# EAGLE design TreeRocketometer (EAGLE 6.2)
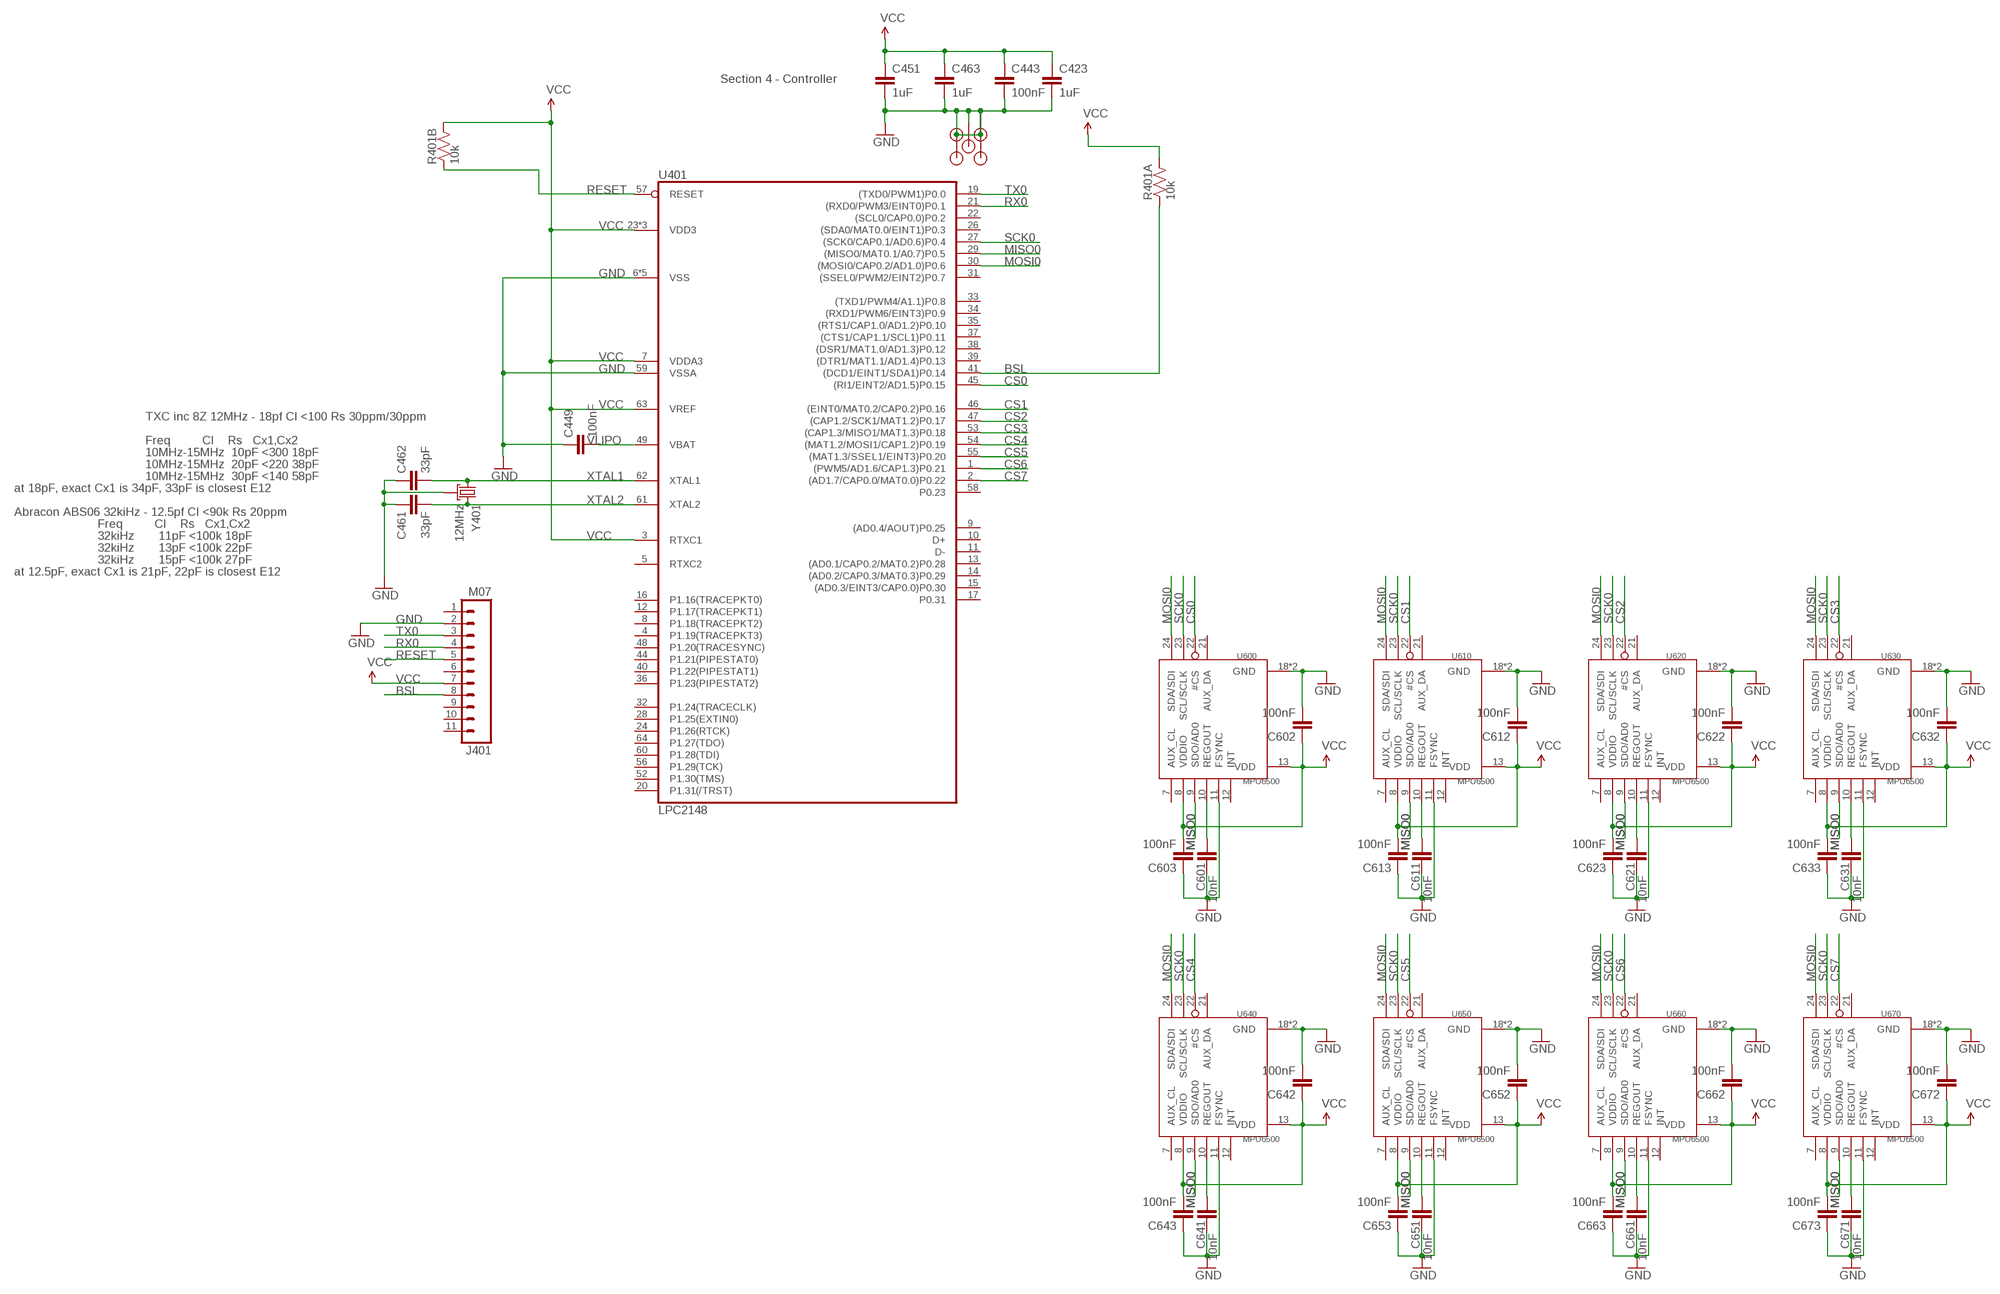
[diagram p0: schematic, sheet 1]

## Parts
C423  1uF  CAP0402-CAP  [0402-CAP]
C443  100nF  CAP0402-CAP  [0402-CAP]
C449  100nF  CAP0402-CAP  [0402-CAP]
C451  1uF  CAP0402-CAP  [0402-CAP]
C461  33pF  CAP0402-CAP  [0402-CAP]
C462  33pF  CAP0402-CAP  [0402-CAP]
C463  1uF  CAP0402-CAP  [0402-CAP]
C601  10nF  CAP0402-CAP  [0402-CAP]
C602  100nF  CAP0402-CAP  [0402-CAP]
C603  100nF  CAP0402-CAP  [0402-CAP]
C611  10nF  CAP0402-CAP  [0402-CAP]
C612  100nF  CAP0402-CAP  [0402-CAP]
C613  100nF  CAP0402-CAP  [0402-CAP]
C621  10nF  CAP0402-CAP  [0402-CAP]
C622  100nF  CAP0402-CAP  [0402-CAP]
C623  100nF  CAP0402-CAP  [0402-CAP]
C631  10nF  CAP0402-CAP  [0402-CAP]
C632  100nF  CAP0402-CAP  [0402-CAP]
C633  100nF  CAP0402-CAP  [0402-CAP]
C641  10nF  CAP0402-CAP  [0402-CAP]
C642  100nF  CAP0402-CAP  [0402-CAP]
C643  100nF  CAP0402-CAP  [0402-CAP]
C651  10nF  CAP0402-CAP  [0402-CAP]
C652  100nF  CAP0402-CAP  [0402-CAP]
C653  100nF  CAP0402-CAP  [0402-CAP]
C661  10nF  CAP0402-CAP  [0402-CAP]
C662  100nF  CAP0402-CAP  [0402-CAP]
C663  100nF  CAP0402-CAP  [0402-CAP]
C671  10nF  CAP0402-CAP  [0402-CAP]
C672  100nF  CAP0402-CAP  [0402-CAP]
C673  100nF  CAP0402-CAP  [0402-CAP]
J401  M07  M11PTH  [1X11]
JP1  STANDOFF  [STANDOFF]
JP2  STANDOFF  [STANDOFF]
JP3  STANDOFF  [STANDOFF]
JP4  STANDOFF  [STANDOFF]
JP5  STANDOFF  [STANDOFF]
R401  10k  RP404  [CRA04]
U401  LPC2148  [LQFP64]
U600  MPU6500  [QFN24]
U610  MPU6500  [QFN24]
U620  MPU6500  [QFN24]
U630  MPU6500  [QFN24]
U640  MPU6500  [QFN24]
U650  MPU6500  [QFN24]
U660  MPU6500  [QFN24]
U670  MPU6500  [QFN24]
Y401  12MHz  CX2520  [CRYSTAL_SMD_2MM_2_5MM]

## Nets
BSL: J401.8 R401.1 U401.41((DCD1/EINT1/SDA1)P0.14)
CS0: U401.45((RI1/EINT2/AD1.5)P0.15) U600.22(#CS)
CS1: U401.46((EINT0/MAT0.2/CAP0.2)P0.16) U610.22(#CS)
CS2: U401.47((CAP1.2/SCK1/MAT1.2)P0.17) U620.22(#CS)
CS3: U401.53((CAP1.3/MISO1/MAT1.3)P0.18) U630.22(#CS)
CS4: U401.54((MAT1.2/MOSI1/CAP1.2)P0.19) U640.22(#CS)
CS5: U401.55((MAT1.3/SSEL1/EINT3)P0.20) U650.22(#CS)
CS6: U401.1((PWM5/AD1.6/CAP1.3)P0.21) U660.22(#CS)
CS7: U401.2((AD1.7/CAP0.0/MAT0.0)P0.22) U670.22(#CS)
GND [power]: C423.2 C443.2 C449.1 C451.2 C461.1 C462.1 C463.2 C601.2 C602.2 C603.1 C611.2 C612.2 C613.1 C621.2 C622.2 C623.1 C631.2 C632.2 C633.1 C641.2 C642.2 C643.1 C651.2 C652.2 C653.1 C661.2 C662.2 C663.1 C671.2 C672.2 C673.1 J401.2 JP1.P$1 JP2.P$1 JP3.P$1 JP4.P$1 JP5.P$1 U401.6(VSS) U401.18(VSS) U401.25(VSS) U401.42(VSS) U401.50(VSS) U401.59(VSSA) U600.11(FSYNC) U600.18(GND) U600.20(GND) U610.11(FSYNC) U610.18(GND) U610.20(GND) U620.11(FSYNC) U620.18(GND) U620.20(GND) U630.11(FSYNC) U630.18(GND) U630.20(GND) U640.11(FSYNC) U640.18(GND) U640.20(GND) U650.11(FSYNC) U650.18(GND) U650.20(GND) U660.11(FSYNC) U660.18(GND) U660.20(GND) U670.11(FSYNC) U670.18(GND) U670.20(GND) Y401.2(GND) Y401.4(GND)
MISO0: U401.29((MISO0/MAT0.1/A0.7)P0.5) U600.9(SDO/AD0) U610.9(SDO/AD0) U620.9(SDO/AD0) U630.9(SDO/AD0) U640.9(SDO/AD0) U650.9(SDO/AD0) U660.9(SDO/AD0) U670.9(SDO/AD0)
MOSI0: U401.30((MOSI0/CAP0.2/AD1.0)P0.6) U600.24(SDA/SDI) U610.24(SDA/SDI) U620.24(SDA/SDI) U630.24(SDA/SDI) U640.24(SDA/SDI) U650.24(SDA/SDI) U660.24(SDA/SDI) U670.24(SDA/SDI)
N$1: C611.1 U610.10(REGOUT)
N$2: C621.1 U620.10(REGOUT)
N$3: C601.1 U600.10(REGOUT)
N$4: C631.1 U630.10(REGOUT)
N$5: C641.1 U640.10(REGOUT)
N$6: C651.1 U650.10(REGOUT)
N$7: C661.1 U660.10(REGOUT)
N$8: C671.1 U670.10(REGOUT)
RESET [power]: J401.5 R401.2 U401.57(RESET)
RX0: J401.4 U401.21((RXD0/PWM3/EINT0)P0.1)
SCK0: U401.27((SCK0/CAP0.1/AD0.6)P0.4) U600.23(SCL/SCLK) U610.23(SCL/SCLK) U620.23(SCL/SCLK) U630.23(SCL/SCLK) U640.23(SCL/SCLK) U650.23(SCL/SCLK) U660.23(SCL/SCLK) U670.23(SCL/SCLK)
TX0: J401.3 U401.19((TXD0/PWM1)P0.0)
VCC [power]: C423.1 C443.1 C451.1 C463.1 C602.1 C603.2 C612.1 C613.2 C622.1 C623.2 C632.1 C633.2 C642.1 C643.2 C652.1 C653.2 C662.1 C663.2 C672.1 C673.2 J401.7 R401.7 R401.8 U401.3(RTXC1) U401.7(VDDA3) U401.23(VDD3) U401.43(VDD3) U401.51(VDD3) U401.63(VREF) U600.8(VDDIO) U600.13(VDD) U610.8(VDDIO) U610.13(VDD) U620.8(VDDIO) U620.13(VDD) U630.8(VDDIO) U630.13(VDD) U640.8(VDDIO) U640.13(VDD) U650.8(VDDIO) U650.13(VDD) U660.8(VDDIO) U660.13(VDD) U670.8(VDDIO) U670.13(VDD)
VLIPO [power]: C449.2 U401.49(VBAT)
XTAL1: C462.2 U401.62(XTAL1) Y401.1
XTAL2: C461.2 U401.61(XTAL2) Y401.3
Unconnected: J401.1 J401.6 J401.9 J401.10 J401.11 R401.3 R401.4 R401.5 R401.6 U401.4(P1.19(TRACEPKT3)) U401.5(RTXC2) U401.8(P1.18(TRACEPKT2)) U401.9((AD0.4/AOUT)P0.25) U401.10(D+) U401.11(D-) U401.12(P1.17(TRACEPKT1)) U401.13((AD0.1/CAP0.2/MAT0.2)P0.28) U401.14((AD0.2/CAP0.3/MAT0.3)P0.29) U401.15((AD0.3/EINT3/CAP0.0)P0.30) U401.16(P1.16(TRACEPKT0)) U401.17(P0.31) U401.20(P1.31(/TRST)) U401.22((SCL0/CAP0.0)P0.2) U401.24(P1.26(RTCK)) U401.26((SDA0/MAT0.0/EINT1)P0.3) U401.28(P1.25(EXTIN0)) U401.31((SSEL0/PWM2/EINT2)P0.7) U401.32(P1.24(TRACECLK)) U401.33((TXD1/PWM4/A1.1)P0.8) U401.34((RXD1/PWM6/EINT3)P0.9) U401.35((RTS1/CAP1.0/AD1.2)P0.10) U401.36(P1.23(PIPESTAT2)) U401.37((CTS1/CAP1.1/SCL1)P0.11) U401.38((DSR1/MAT1.0/AD1.3)P0.12) U401.39((DTR1/MAT1.1/AD1.4)P0.13) U401.40(P1.22(PIPESTAT1)) U401.44(P1.21(PIPESTAT0)) U401.48(P1.20(TRACESYNC)) U401.52(P1.30(TMS)) U401.56(P1.29(TCK)) U401.58(P0.23) U401.60(P1.28(TDI)) U401.64(P1.27(TDO)) U600.7(AUX_CL) U600.12(INT) U600.21(AUX_DA) U610.7(AUX_CL) U610.12(INT) U610.21(AUX_DA) U620.7(AUX_CL) U620.12(INT) U620.21(AUX_DA) U630.7(AUX_CL) U630.12(INT) U630.21(AUX_DA) U640.7(AUX_CL) U640.12(INT) U640.21(AUX_DA) U650.7(AUX_CL) U650.12(INT) U650.21(AUX_DA) U660.7(AUX_CL) U660.12(INT) U660.21(AUX_DA) U670.7(AUX_CL) U670.12(INT) U670.21(AUX_DA)

## Notes on the sheet
- Section 4 - Controller
- TXC inc 8Z 12MHz - 18pf Cl <100 Rs 30ppm/30ppm
- Freq         Cl    Rs   Cx1,Cx2
- 10MHz-15MHz  10pF <300 18pF
- 10MHz-15MHz  20pF <220 38pF
- 10MHz-15MHz  30pF <140 58pF
- at 18pF, exact Cx1 is 34pF, 33pF is closest E12
- Abracon ABS06 32kiHz - 12.5pf Cl <90k Rs 20ppm
- Freq         Cl    Rs   Cx1,Cx2
- 32kiHz       11pF <100k 18pF
- 32kiHz       13pF <100k 22pF
- 32kiHz       15pF <100k 27pF
- at 12.5pF, exact Cx1 is 21pF, 22pF is closest E12

## Library data of the parts
C423 C451 C463 = SparkFun:CAP: Capacitor Standard 0603 ceramic capacitor, and 0.1" leaded capacitor.; DIGIKEY: 445-4114-1-ND
C443 C449 C601-C603 C611-C613 C621-C623 C631-C633 C641-C643 C651-C653 C661-C663 C671-C673 = SparkFun:CAP: Capacitor Standard 0603 ceramic capacitor, and 0.1" leaded capacitor.; DIGIKEY: 445-1265-1-ND
C461 C462 = SparkFun:CAP: Capacitor Standard 0603 ceramic capacitor, and 0.1" leaded capacitor.; DIGIKEY: 445-1241-1-ND
J401 = SparkFun-Connectors:M11: Header 11 Standard 11-pin 0.1" header. Use with straight break away headers (SKU : PRT-00116), right angle break away headers (PRT-00553), swiss pins (PRT-00743), machine pins (PRT-00117), and female headers (PRT-00115).; DIGIKEY: $NOPART
JP1-JP5 = KwanSystems:STANDOFF; DIGIKEY: $NOPART
R401 = KwanSystems:RP4; DIGIKEY: CRA4S810KCT-ND
U401 = KwanSystems:LPC2148
U600 U610 U620 U630 U640 U650 U660 U670 = KwanSystems:MPU6500
Y401 = KwanSystems:CX2520; DIGIKEY: 887-1487-1-ND

## Net classes
0 default: width 0.152 mm, drill 0.33 mm, clearance 0.152 mm
1 power: width 0.152 mm, drill 0.33 mm, clearance 0.152 mm to class 0, clearance 0.152 mm
2 hv: width 0.152 mm, drill 0.33 mm, clearance 0.152 mm to class 0, clearance 0.152 mm to class 1, clearance 0.152 mm

## Board
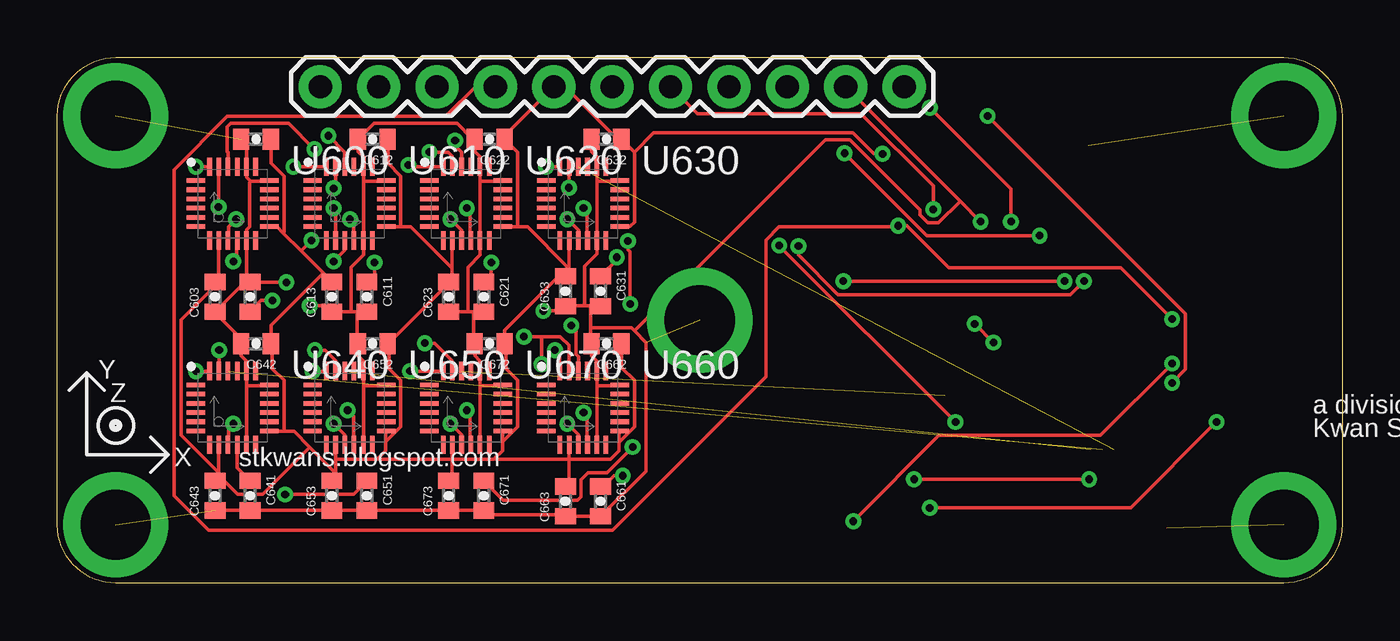
[diagram p1: board, top side]
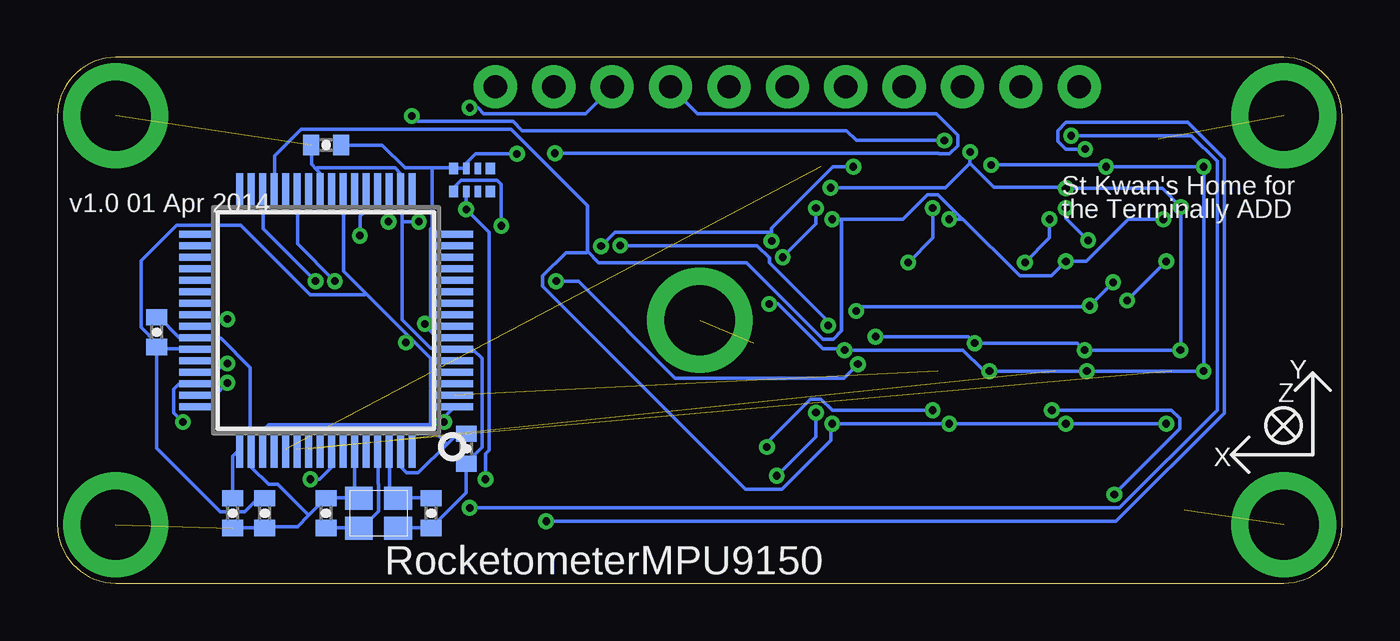
[diagram p2: board, bottom side, seen from below]

Size 55.88 x 22.86 mm. Coordinates in mm from the lower left corner, seen from the top.
Outline: 2.54,22.86 53.34,22.86 arc-90 55.88,20.32 55.88,2.54 arc-90 53.34,0 2.54,0 arc-90 0,2.54 0,20.32 arc-90 2.54,22.86
Copper layers (1*16): Top 0.0356mm / dielectric 1.5011mm / Bottom 0.0356mm
Design rules: minimum track width 6mil, minimum drill 13mil, track to track 6mil, track to pad 6mil, pad to pad 6mil, via to via 6mil, smd to smd 6mil, copper to edge 15mil, drill to drill 6mil, minimum pad ring 7mil, minimum via ring 7mil, stop-mask expansion 4mil, vias tented up to drill 14mil, thermal gap 10mil

### Footprints (pad centres in the part's own frame; a part is rotated, then mirrored left to right if it is on the bottom)
0402-CAP = smd 0.7 x 0.9: 1 -0.65,0; 2 0.65,0
1X11 = drill 1.016 pad 1.88: 1 0,0; 2 2.54,0; 3 5.08,0; 4 7.62,0; 5 10.16,0; 6 12.7,0; 7 15.24,0; 8 17.78,0; 9 20.32,0; 10 22.86,0; 11 25.4,0
STANDOFF = drill 3.048 pad 4.572: P$1 0,0
CRA04 = smd 0.4 x 0.5: 1 -0.8,-0.5; 4 0.8,-0.5; 5 0.8,0.5; 8 -0.8,0.5 | smd 0.3 x 0.5: 2 -0.25,-0.5; 3 0.25,-0.5; 6 0.25,0.5; 7 -0.25,0.5
LQFP64 = smd 0.3 x 1.6: 1 -3.75,-5.6; 2 -3.25,-5.6; 3 -2.75,-5.6; 4 -2.25,-5.6; 5 -1.75,-5.6; 6 -1.25,-5.6; 7 -0.75,-5.6; 8 -0.25,-5.6; 9 0.25,-5.6; 10 0.75,-5.6; 11 1.25,-5.6; 12 1.75,-5.6; 13 2.25,-5.6; 14 2.75,-5.6; 15 3.25,-5.6; 16 3.75,-5.6; 33 3.75,5.6; 34 3.25,5.6; 35 2.75,5.6; 36 2.25,5.6; 37 1.75,5.6; 38 1.25,5.6; 39 0.75,5.6; 40 0.25,5.6; 41 -0.25,5.6; 42 -0.75,5.6; 43 -1.25,5.6; 44 -1.75,5.6; 45 -2.25,5.6; 46 -2.75,5.6; 47 -3.25,5.6; 48 -3.75,5.6 | smd 1.6 x 0.3: 17 5.6,-3.75; 18 5.6,-3.25; 19 5.6,-2.75; 20 5.6,-2.25; 21 5.6,-1.75; 22 5.6,-1.25; 23 5.6,-0.75; 24 5.6,-0.25; 25 5.6,0.25; 26 5.6,0.75; 27 5.6,1.25; 28 5.6,1.75; 29 5.6,2.25; 30 5.6,2.75; 31 5.6,3.25; 32 5.6,3.75; 49 -5.6,3.75; 50 -5.6,3.25; 51 -5.6,2.75; 52 -5.6,2.25; 53 -5.6,1.75; 54 -5.6,1.25; 55 -5.6,0.75; 56 -5.6,0.25; 57 -5.6,-0.25; 58 -5.6,-0.75; 59 -5.6,-1.25; 60 -5.6,-1.75; 61 -5.6,-2.25; 62 -5.6,-2.75; 63 -5.6,-3.25; 64 -5.6,-3.75
QFN24 = smd 0.8 x 0.2: 1 -1.6,1; 2 -1.6,0.6; 3 -1.6,0.2; 4 -1.6,-0.2; 5 -1.6,-0.6; 6 -1.6,-1; 13 1.6,-1; 14 1.6,-0.6; 15 1.6,-0.2; 16 1.6,0.2; 17 1.6,0.6; 18 1.6,1 | smd 0.2 x 0.8: 7 -1,-1.6; 8 -0.6,-1.6; 9 -0.2,-1.6; 10 0.2,-1.6; 11 0.6,-1.6; 12 1,-1.6; 19 1,1.6; 20 0.6,1.6; 21 0.2,1.6; 22 -0.2,1.6; 23 -0.6,1.6; 24 -1,1.6
CRYSTAL_SMD_2MM_2_5MM = smd 1.2 x 1: 1 -0.85,-0.65; 2 0.85,-0.65; 3 0.85,0.65; 4 -0.85,0.65

### Placement (x,y rotation side)
C423  44.2,19.05 180 bottom
C443  51.56,10.92 90 bottom
C449  48.26,3.05 90 bottom
C451  46.86,3.05 270 bottom
C461  44.2,3.05 270 bottom
C462  39.62,3.05 90 bottom
C463  38.1,5.84 270 bottom
C601  8.38,12.45 90 top
C602  8.64,19.3 180 top
C603  6.86,12.45 90 top
C611  13.46,12.45 270 top
C612  13.72,19.3 180 top
C613  11.94,12.45 90 top
C621  18.54,12.45 270 top
C622  18.8,19.3 180 top
C623  17.02,12.45 90 top
C631  23.62,12.7 270 top
C632  23.88,19.3 180 top
C633  22.1,12.7 90 top
C641  8.38,3.81 270 top
C642  8.64,10.41 180 top
C643  6.86,3.81 90 top
C651  13.46,3.81 270 top
C652  13.72,10.41 180 top
C653  11.94,3.81 90 top
C661  23.62,3.56 270 top
C662  23.88,10.41 180 top
C663  22.1,3.56 90 top
C671  18.54,3.81 270 top
C672  18.8,10.41 180 top
C673  17.02,3.81 90 top
J401  36.83,21.59 180 top
JP1  2.54,2.54 0 top
JP2  2.54,20.32 0 top
JP3  27.94,11.43 0 top
JP4  53.34,2.54 0 top
JP5  53.34,20.32 0 top
R401  37.85,17.53 0 bottom
U401  44.2,11.43 90 bottom
U600  7.62,16.51 0 top
U610  12.7,16.51 0 top
U620  17.78,16.51 0 top
U630  22.86,16.51 0 top
U640  7.62,7.62 0 top
U650  12.7,7.62 0 top
U660  22.86,7.62 0 top
U670  17.78,7.62 0 top
U$4  [AXES]  1.27,5.59 0 top
Y401  41.91,3.05 180 bottom

### Tracks (layer width: path | path; a pad name or v marks a point on that pad's centre or on a via)
BSL  (via drill 0.33)
  Top 0.152: v48.49,11.48 46.25,13.72 38.79,13.72 36.96,15.54 v36.58,15.54 36.52,15.49 31.39,15.49 30.81,14.91 30.81,8.97 24.16,2.31 6.58,2.31 5.08,3.81 5.08,17.98 7.39,20.3 16.89,20.3 18.19,21.59 J401.8
  Bottom 0.152: v36.58,15.54 36.58,17.35 36.75,17.53 38.33,17.53 38.63,17.22 38.63,17.04 R401.1 | v48.49,11.48 48.72,11.48 49,11.2 49.78,11.2 U401.41
CS0  (via drill 0.33)
  Top 0.152: v11.18,18.87 10.06,19.99 7.54,19.99 7.39,19.84 7.39,18.77 7.42,18.75 U600.22 | v34.62,2.69 38.35,6.43 45.36,6.43 v48.49,9.55
  Bottom 0.152: v11.18,18.87 12.01,18.87 12.37,19.23 12.37,19.68 12.01,20.04 6.71,20.04 5.13,18.47 5.13,7.39 9.83,2.69 v34.62,2.69 | v48.49,9.55 48.64,9.55 49,9.2 49.78,9.2 U401.45
CS1  (via drill 0.33)
  Top 0.152: v11.79,19.46 12.5,18.75 U610.22 | v37.95,3.28 46.69,3.28 v50.42,7.01
  Bottom 0.152: v11.79,19.46 6.55,19.46 5.44,18.34 5.44,7.52 9.68,3.28 v37.95,3.28 | v50.42,7.01 50.83,7.42 50.83,8.43 50.6,8.66 49.81,8.66 U401.46
CS2  (via drill 0.33)
  Top 0.152: v17.3,19.25 17.3,19.02 17.58,18.75 U620.22 | v40.46,20.32 49.07,11.71 49.07,9.3 v48.49,8.71
  Bottom 0.152: v17.3,19.25 21.13,19.25 21.57,19.68 35.66,19.68 36.07,20.09 40.23,20.09 v40.46,20.32 | v48.49,8.71 49,8.2 49.78,8.2 U401.47
CS3  (1 unrouted)
CS4  (1 unrouted)
CS5  (1 unrouted)
CS6  (via drill 0.33)
  Top 0.152: v22.35,11.2 22.55,11 22.55,9.96 22.66,9.86 U660.22 | v39.06,7.01 v31.39,14.68
  Bottom 0.152: v22.35,11.2 22.35,11.38 24.92,13.95 24.92,14.15 25.45,14.68 v31.39,14.68 | v39.06,7.01 39.06,7.21 U401.1
CS7  (1 unrouted)
GND  (via drill 0.33)  (5 unrouted)
  Top 0.152: U620.18 19.3,17.5 19,17.5 18.97,17.48 18.39,17.48 | 18.39,17.48 18.39,18.09 U620.20 | 18.39,17.48 18.39,14.94 U620.11 18.39,14.83 18.39,14.28 17.86,13.74 17.86,11.81 | U620.20 | U620.20 18.39,18.19 18.39,18.54 18.16,18.77 18.16,19.3 C622.2 18.09,19.33 18.03,19.33 17.37,19.99 13.77,19.99 13.13,19.36 C612.2 13.08,18.77 13.31,18.54 13.31,18.19 U610.20 | 17.86,11.81 C621.2 18.11,11.76 18.11,10.46 C672.2 18.16,10.41 18.16,9.88 18.39,9.65 18.39,9.3 U670.20 | 17.86,11.81 C623.1 | U670.18 19.3,8.61 19,8.61 18.97,8.59 18.39,8.59 | 18.39,8.59 18.39,9.2 U670.20 | 18.39,8.59 18.39,6.04 U670.11 | U670.20 | U640.18 9.14,8.61 8.84,8.61 8.81,8.59 8.23,8.59 | 8.23,8.59 8.23,9.2 U640.20 | 8.23,8.59 8.23,6.04 U640.11 | U640.20 | U640.20 8.23,9.3 8.23,9.65 8,9.88 C642.2 7.95,10.46 7.95,10.67 6.88,11.73 C603.1 8.23,13.18 C601.2 | U600.18 9.14,17.5 8.84,17.5 8.81,17.48 8.41,17.48 | U600.20 | U600.20 8.23,18.19 8.23,19.07 C602.2 | 8.41,17.48 8.23,17.65 8.23,18.03 U600.20 | C601.2 8.23,13.26 U600.11 8.23,14.99 8.23,15.37 8.36,15.49 8.36,17.42 8.41,17.48 | U610.18 14.22,17.5 13.92,17.5 13.89,17.48 13.31,17.48 | 13.31,17.48 13.31,18.09 U610.20 | 13.31,17.48 13.31,14.94 U610.11 13.31,14.83 13.31,14.28 12.78,13.74 12.78,11.81 | U610.20 | 12.78,11.81 C611.2 13.03,11.76 13.03,10.46 C652.2 13.08,9.88 13.31,9.65 13.31,9.3 U650.20 | 12.78,11.81 C613.1 11.89,11.86 11.68,12.06 v10.97,12.06 | U650.18 14.22,8.61 13.92,8.61 13.89,8.59 13.31,8.59 | 13.31,8.59 13.31,9.2 U650.20 | 13.31,8.59 13.31,6.04 U650.11 | U650.20 | v9.96,13.08 8.46,13.08 C601.2 | U630.18 24.38,17.5 24.08,17.5 24.05,17.48 23.47,17.48 | 23.47,17.48 23.47,18.09 U630.20
  Top 0.152: 23.47,17.48 23.47,14.94 U630.11 23.47,14.83 23.47,14.33 22.94,13.79 22.94,12.06 | U630.20 | C632.2 23.24,18.77 23.47,18.54 23.47,18.19 U630.20 | 22.94,12.06 23.62,12.06 C631.2 23.19,12.01 23.19,11.1 | 22.94,12.06 22.1,12.06 C633.1 22.05,12.01 21.87,11.84 v21.13,11.84 | U660.18 24.38,8.61 24.08,8.61 24.05,8.59 23.47,8.59 | 23.47,8.59 23.47,9.2 U660.20 | 23.47,8.59 23.47,6.04 U660.11 | U660.20 | U660.20 23.47,9.3 23.47,9.65 23.24,9.88 C662.2 23.19,10.46 23.19,11.1 | C643.1 6.86,3.17 8.38,3.17 C641.2 8.43,3.17 11.89,3.17 C653.1 11.94,3.17 13.46,3.17 C651.2 13.51,3.17 16.97,3.17 C673.1 17.02,3.17 18.54,3.17 C671.2 18.59,3.12 18.75,2.97 22.05,2.97 C663.1 22.1,2.92 23.62,2.92 C661.2 23.67,2.95 25.6,4.88 25.6,10.46 25.09,10.97 | 23.19,11.1 24.97,11.1 25.09,10.97 | v40.16,15.72 39.27,16.61 | 39.27,16.61 J401.2 | 25.09,10.97 33.4,19.28 34.47,19.28 37.52,16.23 37.52,16.03 37.87,15.67 38.33,15.67 39.27,16.61
  Bottom 0.152: v9.96,13.08 v10.97,12.06 11.02,12.01 20.95,12.01 v21.13,11.84 | 44.63,18.01 44.45,17.83 44.45,17.04 U401.25 | 44.63,18.01 44.83,18.21 44.83,19.05 C423.2 | 44.63,18.01 44.58,18.06 41.2,18.06 40.97,17.83 40.97,17.04 U401.18 40.89,16.97 40.89,15.72 | C443.2 51.56,11.56 51.46,11.56 50.6,10.69 49.81,10.69 U401.42 49.73,10.64 48.77,10.64 47.5,9.37 47.5,5.89 U401.50 47.42,5.82 47.42,5.03 46.69,4.29 46.3,4.29 44.96,2.95 | C449.1 48.26,2.41 46.86,2.41 C451.2 46.81,2.46 45.44,2.46 44.96,2.95 | Y401.4 41.05,2.41 39.62,2.41 C462.1 39.57,2.46 38.1,3.94 C463.2 38.08,5.26 37.41,5.92 37.41,9.78 37.8,10.16 38.58,10.16 U401.6 38.66,10.21 39.65,10.21 40.89,11.46 40.89,15.72 | 44.96,2.95 44.25,3.66 C461.1 42.77,3.71 Y401.2 42.95,3.76 42.95,5.82 U401.59 | 40.89,15.72 v40.16,15.72
MISO0  (via drill 0.33)
  Top 0.152: v7.64,6.93 7.44,6.73 7.44,6.04 U640.9 | v12.01,6.93 12.5,6.45 12.5,6.04 U650.9 | v17.09,6.93 17.58,6.45 17.58,6.04 U670.9 | v22.17,6.93 22.66,6.45 22.66,6.04 U660.9 | v7.77,15.82 7.44,15.49 7.44,14.94 U600.9 | v12.01,13.99 12.5,14.48 U610.9 | v17.09,15.82 17.58,15.34 17.58,14.94 U620.9 | v22.17,15.82 22.66,15.34 22.66,14.94 U630.9
  Bottom 0.152: v7.64,6.93 v12.01,6.93 v17.09,6.93 v22.17,6.93 22.23,6.88 22.23,6.22 24.36,4.09 25.96,4.09 34.77,12.9 34.77,13.36 33.76,14.38 32.87,14.38 32.82,14.43 | v7.77,15.82 9.3,15.82 11.12,13.99 v12.01,13.99 12.65,13.36 14.02,13.36 16.48,15.82 16.56,15.82 | 16.56,15.82 v17.09,15.82 | 21.77,15.82 19.1,15.82 18.03,16.89 17.58,16.89 16.56,15.88 16.56,15.82 | 21.77,15.82 v22.17,15.82 | 32.82,14.43 32.82,16.41 36.14,19.74 45.29,19.74 46.43,18.59 46.43,17.04 U401.29 | 32.82,14.43 32.33,13.95 25.91,13.95 22.58,10.62 22.12,10.62 21.77,10.97 21.77,15.82
MOSI0  (via drill 0.33)
  Top 0.152: v6.02,9.22 6.6,9.22 U640.24 | v11.1,9.22 11.68,9.22 U650.24 | v15.34,9.22 16.76,9.22 U670.24 | v21.64,10.13 21.84,9.93 21.84,9.22 U660.24 | v6.02,18.11 6.6,18.11 U600.24 | v10.26,18.11 11.68,18.11 U610.24 | v15.27,18.19 15.34,18.11 16.76,18.11 U620.24 | v21.26,18.11 21.84,18.11 U630.24 | v24.82,14.88 24.82,14.5 24.92,14.4 v24.92,12.14 | v44.65,13.13 44.07,12.55 33.96,12.55 32.23,14.28 v32.23,14.66
  Bottom 0.152: v15.27,18.19 10.34,18.19 v10.26,18.11 v6.02,18.11 v6.02,9.22 v11.1,9.22 v15.34,9.22 15.39,9.27 15.62,9.27 16.48,10.13 v21.64,10.13 21.69,10.19 22.58,10.19 24.54,12.14 v24.92,12.14 | v21.26,18.11 22.15,18.11 24.82,15.44 24.82,15.27 | v24.82,14.88 24.82,15.27 | v44.65,13.13 46.94,15.42 46.94,17.02 U401.30 | v32.23,14.66 31.62,15.27 24.82,15.27
N$1  (via drill 0.33)
  Top 0.152: v12.72,15.82 12.88,15.67 12.88,14.94 U610.10 | v13.79,13.95 13.79,13.44 C611.1
  Bottom 0.152: v12.72,15.82 12.72,15.01 v13.79,13.95
N$2  (via drill 0.33)
  Top 0.152: v17.8,16.31 17.96,16.15 17.96,14.94 U620.10 | v18.87,13.95 18.87,13.44 C621.1
  Bottom 0.152: v17.8,16.31 17.8,15.01 v18.87,13.95
N$3  (via drill 0.33)
  Top 0.152: v7.64,13.99 7.8,14.15 7.8,14.91 U600.10 | v9.35,12.29 8.87,12.29 C601.1
  Bottom 0.152: v9.35,12.29 v7.64,13.99
N$4  (via drill 0.33)
  Top 0.152: v22.89,16.31 23.04,16.15 23.04,14.94 U630.10 | v24.33,14.17 24.33,14.07 C631.1
  Bottom 0.152: v22.89,16.31 22.89,15.62 v24.33,14.17
N$5
  Top 0.152: U640.10 7.82,5.03 C641.1
N$6  (via drill 0.33)
  Top 0.152: v12.62,7.52 12.88,7.26 12.88,6.04 U650.10 | v9.91,3.86 12.88,3.86 13.46,4.45 C651.1
  Bottom 0.152: v12.62,7.52 7.42,7.52 7.06,7.16 7.06,6.71 v9.91,3.86
N$7  (via drill 0.33)
  Top 0.152: v22.89,7.42 23.04,7.26 23.04,6.04 U660.10 | v24.59,4.67 24.21,4.67 23.75,4.22 C661.1
  Bottom 0.152: v22.89,7.42 22.89,6.38 v24.59,4.67
N$8  (via drill 0.33)
  Top 0.152: v17.8,7.52 17.96,7.37 17.96,6.04 U670.10 | v25.02,5.92 23.9,4.8 23.09,4.8 22.78,4.5 22.78,3.76 22.63,3.61 19.38,3.61 18.54,4.45 C671.1
  Bottom 0.152: v17.8,7.52 22.17,7.52 22.66,8 23.11,8 25.02,6.1 v25.02,5.92
RESET  (via drill 0.33)
  Top 0.152: v38.1,16.26 38.1,17.27 34.95,20.42 27.84,20.42 J401.5 | v37.26,4.52 v44.88,4.52
  Bottom 0.152: R401.2 38.1,17.02 v38.1,16.26 37.11,15.27 37.11,5.79 37.26,5.64 v37.26,4.52 | v44.88,4.52 44.48,4.52 43.97,5.03 43.97,5.82 U401.57
RX0  (via drill 0.33)
  Top 0.152: v42.72,15.11 37.82,15.11 v34.24,18.69
  Bottom 0.152: v42.72,15.11 42.72,15.95 42.47,16.2 42.47,17.02 U401.21 | v34.24,18.69 17.55,18.69 17.53,18.67 17.07,18.67 16.71,19.02 16.71,19.48 17.65,20.42 28.04,20.42 J401.4
SCK0  (via drill 0.33)
  Top 0.152: v7.04,10.13 7.04,9.22 U640.23 | v11.2,10.13 11.63,10.13 12.09,9.68 U650.23 | v15.98,10.44 16.41,10.44 17.17,9.68 U670.23 | v20.3,10.72 21.06,10.72 | 21.06,10.72 21.87,10.72 22.25,10.34 U660.23 | v7.01,16.36 7.01,18.09 U600.23 | v12.01,17.17 12.09,17.25 12.09,18.09 U610.23 | v16.18,18.75 16.99,18.75 17.17,18.57 U620.23 | v22.25,17.2 22.25,18.09 U630.23 | v34.19,13.13 v43.81,13.13 | 21.06,10.72 v21.06,9.53
  Bottom 0.152: v20.3,10.72 16.26,10.72 v15.98,10.44 11.51,10.44 v11.2,10.13 v7.04,10.13 7.01,10.19 v7.01,16.36 7.82,17.17 v12.01,17.17 12.06,17.22 15.14,17.22 16.18,18.26 | 16.18,18.26 v16.18,18.75 | v22.25,17.2 17.25,17.2 16.18,18.26 | v43.81,13.13 45.44,14.76 45.44,17.02 U401.27 | v34.19,13.13 33.22,13.13 29.01,8.91 21.67,8.91 v21.06,9.53
TX0  (via drill 0.33)
  Top 0.152: v41.48,15.72 41.48,17.14 v37.95,20.68
  Bottom 0.152: v41.48,15.72 41.45,15.75 41.45,17.02 U401.19 | v37.95,20.68 37.59,20.68 37.34,20.42 32.92,20.42 J401.3
VCC  (via drill 0.33)
  Top 0.152: v40.72,10.46 v39.9,11.28 | 22.25,13.74 22.25,13.51 C633.2 22.15,13.69 19.46,11 C672.1 19.51,10.36 19.51,9.32 20.02,8.81 20.02,6.81 19.41,6.2 19.36,6.2 | 22.25,13.74 U630.8 | 20.02,15.49 20.45,15.49 22.2,13.74 22.25,13.74 | 20.02,15.49 19.38,15.49 U620.13 | 25.09,18.75 25.09,15.7 24.92,15.52 U630.13 | 25.09,18.75 C632.1 24.46,19.33 24.33,19.33 22.12,21.54 21.64,21.54 J401.7 19.46,19.46 C622.1 19.51,19.25 20.02,18.75 20.02,15.49 | 17.17,13.74 17.17,13.26 C623.2 16.99,13.03 C652.1 14.43,10.36 14.43,9.32 14.94,8.81 14.94,6.81 14.33,6.2 14.28,6.2 | 17.17,13.74 U620.8 | 14.94,15.49 15.37,15.49 17.12,13.74 17.17,13.74 | 14.94,15.49 14.3,15.49 U610.13 | 14.94,15.49 14.94,17.7 14.38,18.26 C612.1 | 10.59,14.45 C613.2 11.51,13.44 9.3,11.23 C642.1 9.35,10.36 9.35,9.32 9.86,8.81 9.86,6.6 | 10.59,14.45 9.8,15.24 | 9.8,15.24 9.55,15.49 9.22,15.49 U600.13 | v12.01,16.31 12.09,16.23 12.09,14.94 U610.8 | 10.59,14.45 v11.05,14.91 | C602.1 9.3,18.26 9.86,17.7 9.86,15.29 9.8,15.24 | 22.25,5.38 22.25,4.37 C663.2 | 22.25,5.38 U660.8 | 24.43,6.2 24.43,5.77 24.05,5.38 22.25,5.38 | 24.43,6.2 24.43,6.6 U660.13 | C662.1 24.54,9.37 25.09,8.81 25.09,6.81 24.49,6.2 24.43,6.2 | 17.17,5.38 17.17,4.62 C673.2 | 17.17,5.38 U670.8 | 19.36,6.2 19.36,5.77 19.02,5.44 | 19.36,6.2 19.36,6.6 U670.13 | 19.02,5.44 18.97,5.38 17.17,5.38 | U600.8 7.01,13.26 C603.2 6.83,13.03 6.83,12.9 5.38,11.46 5.38,6.43 6.96,4.85 7.01,4.85 | 7.01,4.85 7.01,4.62 C643.2 7.06,4.57 7.14,4.57 7.85,3.86 8.91,3.86 10.97,5.92 | 7.01,4.85 U640.8 | 12.09,4.85 12.09,4.62 C653.2 | 12.09,4.85 12.09,5.38 | 12.09,5.38 U650.8 | 9.86,6.6 10.29,6.6 10.97,5.92
  Top 0.152: 9.86,6.6 9.22,6.6 U640.13 | 10.97,5.92 12.04,4.85 12.09,4.85 | 14.28,6.2 14.28,5.77 13.95,5.44 | 14.28,6.2 14.28,6.6 U650.13 | 13.95,5.44 13.89,5.38 12.09,5.38 | 17.17,5.38 13.99,5.38 13.95,5.44 | 22.25,5.38 19.07,5.38 19.02,5.44 | v35.89,18.67 35.51,18.67 34.59,19.58 25.93,19.58 25.09,18.75
  Bottom 0.152: 39.57,18.06 40.77,18.06 41.76,19.05 C423.1 | 39.57,18.06 38.71,18.06 R401.8 38.63,18.03 R401.7 38.1,18.11 38.1,18.26 37.69,18.67 v35.89,18.67 | 39.65,11.28 39.65,15.42 39.57,15.49 39.57,18.06 | 39.65,11.28 39.65,10.95 39.4,10.69 38.61,10.69 U401.7 | C443.1 51.56,5.87 48.79,3.1 47.73,3.1 47.14,3.68 46.86,3.68 C451.1 | U401.43 51.51,10.19 C443.1 | 38.94,6.04 40.18,4.8 40.69,4.8 40.95,5.05 40.95,5.82 U401.63 | 38.94,6.04 38.51,6.48 38.1,6.48 C463.1 | 39.6,8.46 39.65,8.41 39.65,6.88 | 39.6,8.46 39.4,8.66 38.61,8.66 U401.3 | 39.65,6.88 39.65,6.76 38.94,6.04 | 40.53,10.65 39.65,9.78 39.65,8.51 39.6,8.46 | 40.53,10.65 42.47,12.6 | 42.47,12.6 43.43,13.56 43.43,17.02 U401.23 | 39.65,6.88 46.69,6.88 46.94,6.63 46.94,5.84 U401.51 | C443.1 51.59,10.34 51.59,10.46 52.25,11.12 52.25,14.02 50.7,15.57 47.9,15.57 44.88,12.55 42.52,12.55 42.47,12.6 | v39.9,11.28 39.65,11.28 | 40.53,10.65 v40.72,10.46 | v12.01,16.31 12.01,15.88 v11.05,14.91
VLIPO
  Bottom 0.152: C449.2 48.26,5.51 47.95,5.82 U401.49
XTAL1
  Bottom 0.152: C462.2 41.05,3.71 Y401.1 41.07,3.79 41.43,4.14 41.43,5.82 U401.62
XTAL2
  Bottom 0.152: C461.2 44.2,2.41 42.77,2.41 Y401.3 42.7,2.44 42.6,2.44 41.91,3.12 41.91,4.29 41.94,4.32 41.94,5.82 U401.61

### Text on the board
tPlace: a division of | Kwan Systems | stkwans.blogspot.com
bPlace: St Kwan's Home for | the Terminally ADD | v1.0 01 Apr 2014 | RocketometerMPU9150